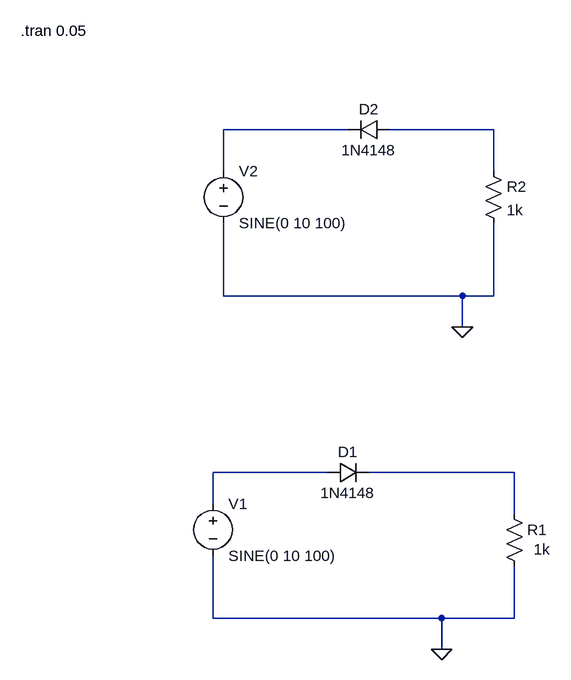
[diagram p0: schematic Ex-4.asc]
Ex-4.asc, the LTspice schematic file:
Version 4
SHEET 1 936 740
WIRE 192 -80 0 -80
WIRE 416 -80 256 -80
WIRE 0 -16 0 -80
WIRE 416 -16 416 -80
WIRE 0 176 0 64
WIRE 368 176 0 176
WIRE 416 176 416 64
WIRE 416 176 368 176
WIRE 368 224 368 176
WIRE 160 448 -16 448
WIRE 448 448 224 448
WIRE -16 496 -16 448
WIRE 448 512 448 448
WIRE -16 672 -16 576
WIRE 336 672 -16 672
WIRE 448 672 448 592
WIRE 448 672 336 672
WIRE 336 720 336 672
FLAG 336 720 0
FLAG 368 224 0
SYMBOL voltage -16 480 R0
WINDOW 123 0 0 Left 0
WINDOW 39 0 0 Left 0
SYMATTR InstName V1
SYMATTR Value SINE(0 10 100)
SYMBOL voltage 0 -32 R0
WINDOW 123 0 0 Left 0
WINDOW 39 0 0 Left 0
SYMATTR InstName V2
SYMATTR Value SINE(0 10 100)
SYMBOL diode 160 464 R270
WINDOW 0 32 32 VTop 2
WINDOW 3 0 32 VBottom 2
SYMATTR InstName D1
SYMATTR Value 1N4148
SYMBOL diode 256 -96 R90
WINDOW 0 0 32 VBottom 2
WINDOW 3 32 32 VTop 2
SYMATTR InstName D2
SYMATTR Value 1N4148
SYMBOL res 432 496 R0
WINDOW 3 46 70 Left 2
SYMATTR InstName R1
SYMATTR Value 1k
SYMBOL res 400 -32 R0
SYMATTR InstName R2
SYMATTR Value 1k
TEXT -312 -232 Left 2 !.tran 0.05

The netlist it stands for:
* Ex-4.asc
V1 N003 0 SINE(0 10 100)
V2 N001 0 SINE(0 10 100)
D1 N003 N004 1N4148
D2 N002 N001 1N4148
R1 N004 0 1k
R2 N002 0 1k
.model D D
.lib standard.dio
.tran 0.05
.backanno
.end